# EAGLE schematic TouScruino-v3 (EAGLE 6.3)
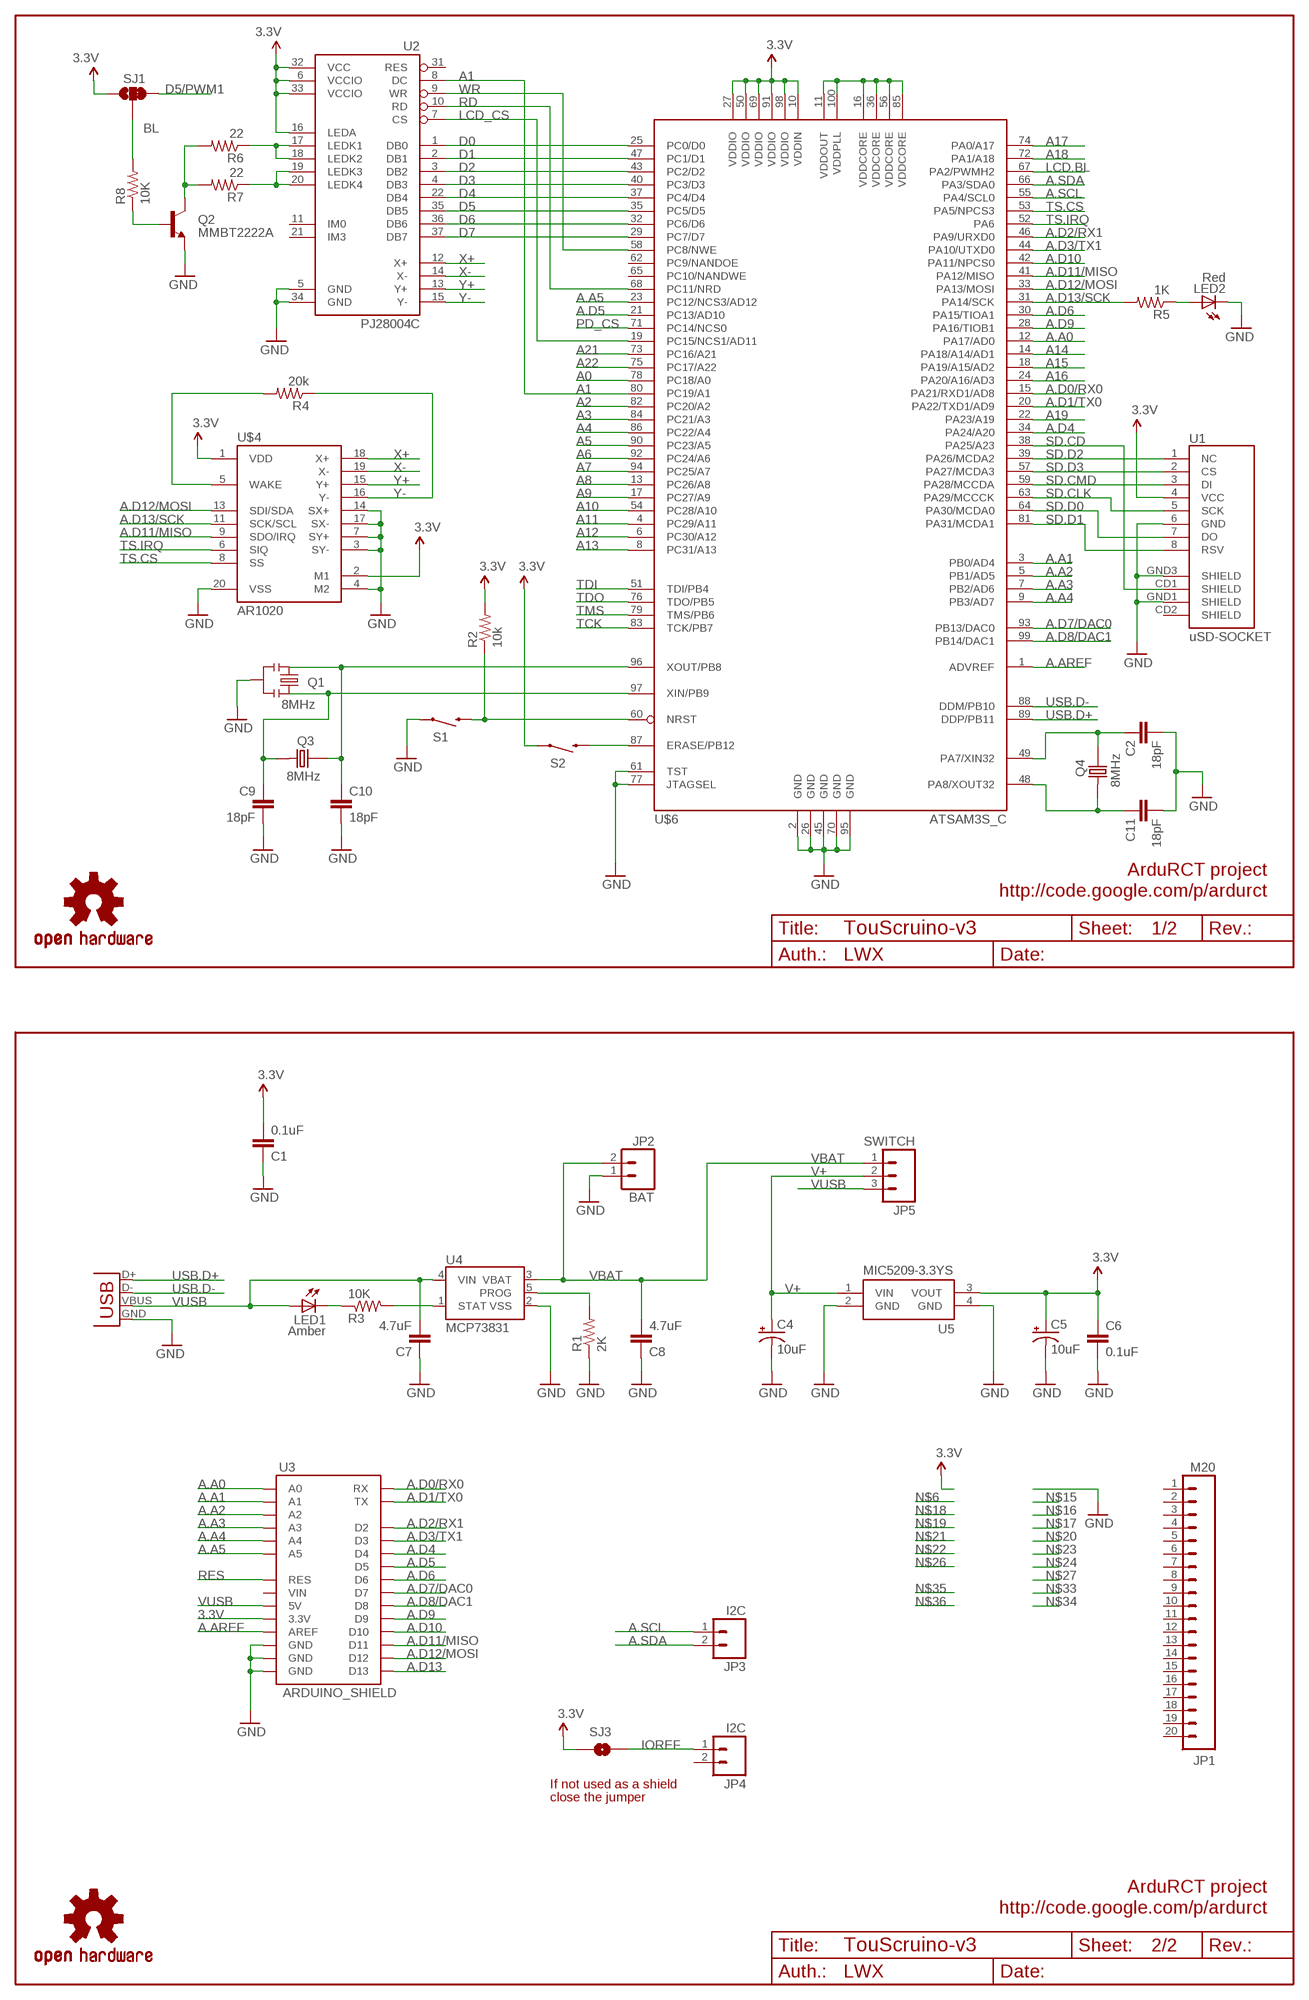
[diagram p0: schematic, sheet 1]

## Parts
C1  0.1uF  CAP0805  [0805]
C2  18pF  CAP0603-CAP  [0603-CAP]
C4  10uF  CAP_POL1206  [EIA3216]
C5  10uF  CAP_POL1206  [EIA3216]
C6  0.1uF  CAP0805  [0805]
C7  4.7uF  CAP0805  [0805]
C8  4.7uF  CAP0805  [0805]
C9  18pF  CAP0603-CAP  [0603-CAP]
C10  18pF  CAP0603-CAP  [0603-CAP]
C11  18pF  CAP0603-CAP  [0603-CAP]
JP1  M20  [1X20]
JP2  BAT  M02-JST-2MM-SMT  [JST-2-SMD]
JP3  I2C  M02  [1X02]
JP4  I2C  M02  [1X02]
JP5  SWITCH  M03  [1X3_LONGPAD]
LED1  Amber  LED  [LED]
LED2  Red  LED805  [LED-0805]
Q1  8MHz  RESONATORSMD  [RESONATOR-SMD]
Q2  MMBT2222A  TRANSISTOR_NPNSOT23-3  [SOT23-3]
Q3  8MHz  CRYSTAL_5X3.2  [CRYSTAL_5X3.2]
Q4  8MHz  CRYSTAL_5X3.2  [CRYSTAL_5X3.2]
R1  2K  RESISTOR0805-RES  [0805]
R2  10k  RESISTOR0805-RES  [0805]
R3  10K  RESISTOR0805-RES  [0805]
R4  20k  RESISTOR0805-RES  [0805]
R5  1K  RESISTOR0805-RES  [0805]
R6  22  RESISTOR0805-RES  [0805]
R7  22  RESISTOR0805-RES  [0805]
R8  10K  RESISTOR0805-RES  [0805]
S1  SWITCH-MOMENTARY-2SMD  [TACTILE_SWITCH_SMD]
S2  SWITCH-MOMENTARY-2SMD  [TACTILE_SWITCH_SMD]
SJ1  SJ_2WAYS_1-2  [SJ_2WAYS_1-2_S]
SJ3  SOLDERJUMPERNO  [SJ_2S-NO]
U1  uSD-SOCKET  USD-SOCKETNEW  [MICRO-SD-SOCKET-PP]
U2  PJ28004C  [PJ28004C]
U3  ARDUINO_SHIELD  [ARDUINO_SHIELD]
U4  MCP73831  [SOT23-5]
U5  MIC5209-3.3YS  MIC5209  [SOT223]
U$3  OSHW-LOGOM  [OSHW-LOGO-M]
U$4  AR1020  [SSOP20]
U$5  OSHW-LOGOM  [OSHW-LOGO-M]
U$6  ATSAM3S_C  [TQFP100]
X1  USBSMD  [USB-MINIB]

## Nets
3.3V: C1.2 C5.A(+) C6.1 R2.2 S2.1 SJ1.3 SJ3.1 U1.4(VCC) U2.6(VCCIO) U2.16(LEDA) U2.32(VCC) U2.33(VCCIO) U3.3.3V U5.3(VOUT) U$4.1(VDD) U$4.2(M1) U$6.10(VDDIN) U$6.27(VDDIO) U$6.50(VDDIO) U$6.69(VDDIO) U$6.91(VDDIO) U$6.98(VDDIO)
A0: U$6.78(PC18/A0)
A1: U2.8(DC) U$6.80(PC19/A1)
A2: U$6.82(PC20/A2)
A3: U$6.84(PC21/A3)
A4: U$6.86(PC22/A4)
A5: U$6.90(PC23/A5)
A6: U$6.92(PC24/A6)
A7: U$6.94(PC25/A7)
A8: U$6.13(PC26/A8)
A9: U$6.17(PC27/A9)
A10: U$6.54(PC28/A10)
A11: U$6.4(PC29/A11)
A12: U$6.6(PC30/A12)
A13: U$6.8(PC31/A13)
A14: U$6.14(PA18/A14/AD1)
A15: U$6.18(PA19/A15/AD2)
A16: U$6.24(PA20/A16/AD3)
A17: U$6.74(PA0/A17)
A18: U$6.72(PA1/A18)
A19: U$6.22(PA23/A19)
A21: U$6.73(PC16/A21)
A22: U$6.75(PC17/A22)
A.A0: U3.A0 U$6.12(PA17/AD0)
A.A1: U3.A1 U$6.3(PB0/AD4)
A.A2: U3.A2 U$6.5(PB1/AD5)
A.A3: U3.A3 U$6.7(PB2/AD6)
A.A4: U3.A4 U$6.9(PB3/AD7)
A.A5: U3.A5 U$6.23(PC12/NCS3/AD12)
A.AREF: U3.AREF U$6.1(ADVREF)
A.D0/RX0: U3.RX U$6.15(PA21/RXD1/AD8)
A.D1/TX0: U3.TX U$6.20(PA22/TXD1/AD9)
A.D2/RX1: U3.D2 U$6.46(PA9/URXD0)
A.D3/TX1: U3.D3 U$6.44(PA10/UTXD0)
A.D4: U3.D4 U$6.34(PA24/A20)
A.D5: U3.D5 U$6.21(PC13/AD10)
A.D6: U3.D6 U$6.30(PA15/TIOA1)
A.D7/DAC0: U3.D7 U$6.93(PB13/DAC0)
A.D8/DAC1: U3.D8 U$6.99(PB14/DAC1)
A.D9: U3.D9 U$6.28(PA16/TIOB1)
A.D10: U3.D10 U$6.42(PA11/NPCS0)
A.D11/MISO: U3.D11 U$4.9(SDO/IRQ) U$6.41(PA12/MISO)
A.D12/MOSI: U3.D12 U$4.13(SDI/SDA) U$6.33(PA13/MOSI)
A.D13: U3.D13
A.D13/SCK: R5.2 U$4.11(SCK/SCL) U$6.31(PA14/SCK)
A.SCL: JP3.1 U$6.55(PA4/SCL0)
A.SDA: JP3.2 U$6.66(PA3/SDA0)
BL: R8.2 SJ1.2
D0: U2.1(DB0) U$6.25(PC0/D0)
D1: U2.2(DB1) U$6.47(PC1/D1)
D2: U2.3(DB2) U$6.43(PC2/D2)
D3: U2.4(DB3) U$6.40(PC3/D3)
D4: U2.22(DB4) U$6.37(PC4/D4)
D5: U2.35(DB5) U$6.35(PC5/D5)
D5/PWM1: SJ1.1
D6: U2.36(DB6) U$6.32(PC6/D6)
D7: U2.37(DB7) U$6.29(PC7/D7)
GND [vcc]: C1.1 C2.2 C4.C(-) C5.C(-) C6.2 C7.1 C8.1 C9.2 C10.2 C11.2 JP2.1 LED2.2(C) Q1.2 Q2.2(E) R1.1 S1.1 U1.6(GND) U1.GND1(SHIELD) U1.GND3(SHIELD) U2.5(GND) U2.34(GND) U3.GND@0(GND) U3.GND@1(GND) U3.GND@2(GND) U4.2(VSS) U5.2(GND) U5.4(GND) U$4.3(SY-) U$4.4(M2) U$4.7(SY+) U$4.14(SX+) U$4.17(SX-) U$4.20(VSS) U$6.2(GND) U$6.26(GND) U$6.45(GND) U$6.61(TST) U$6.70(GND) U$6.77(JTAGSEL) U$6.95(GND) X1.GND
IOREF: JP4.1 SJ3.2
LCD.BL: U$6.67(PA2/PWMH2)
LCD_CS: U2.7(CS) U$6.19(PC15/NCS1/AD11)
N$1: C9.1 Q1.1 Q3.2 U$6.97(XIN/PB9)
N$2: C10.1 Q1.3 Q3.1 U$6.96(XOUT/PB8)
N$4: Q2.1(B) R8.1
N$5: LED2.1(A) R5.1
N$7: Q2.3(C) R6.2 R7.2
N$8: LED1.C1(C) R3.1
N$9: R2.1 S1.3 U$6.60(NRST)
N$10: U$6.11(VDDOUT) U$6.16(VDDCORE) U$6.36(VDDCORE) U$6.56(VDDCORE) U$6.85(VDDCORE) U$6.100(VDDPLL)
N$11: R4.2 U$4.5(WAKE)
N$12: R3.2 U4.1(STAT)
N$13: R1.2 U4.5(PROG)
N$14: S2.3 U$6.87(ERASE/PB12)
N$25: R7.1 U2.19(LEDK3) U2.20(LEDK4)
N$32: R6.1 U2.17(LEDK1) U2.18(LEDK2)
N$45: C2.1 Q4.1 U$6.49(PA7/XIN32)
N$46: C11.1 Q4.2 U$6.48(PA8/XOUT32)
PD_CS: U$6.71(PC14/NCS0)
RD: U2.10(RD) U$6.68(PC11/NRD)
RES: U3.RES
SD.CD: U1.CD1(SHIELD) U$6.38(PA25/A23)
SD.CLK: U1.5(SCK) U$6.63(PA29/MCCCK)
SD.CMD: U1.3(DI) U$6.59(PA28/MCCDA)
SD.D0: U1.7(DO) U$6.64(PA30/MCDA0)
SD.D1: U1.8(RSV) U$6.81(PA31/MCDA1)
SD.D2: U1.1(NC) U$6.39(PA26/MCDA2)
SD.D3: U1.2(CS) U$6.57(PA27/MCDA3)
TCK: U$6.83(TCK/PB7)
TDI: U$6.51(TDI/PB4)
TDO: U$6.76(TDO/PB5)
TMS: U$6.79(TMS/PB6)
TS.CS: U$4.8(SS) U$6.53(PA5/NPCS3)
TS.IRQ: U$4.6(SIQ) U$6.52(PA6)
USB.D+: U$6.89(DDP/PB11) X1.D+
USB.D-: U$6.88(DDM/PB10) X1.D-
V+: C4.A(+) JP5.2 U5.1(VIN)
VBAT: C8.2 JP2.2 JP5.1 U4.3(VBAT)
VUSB: C7.2 JP5.3 LED1.A1(A) U3.5V U4.4(VIN) X1.VBUS
WR: U2.9(WR) U$6.58(PC8/NWE)
X+: U2.12(X+) U$4.18(X+)
X-: U2.14(X-) U$4.19(X-)
Y+: U2.13(Y+) U$4.15(Y+)
Y-: R4.1 U2.15(Y-) U$4.16(Y-)
Unconnected: JP1.1 JP1.2 JP1.3 JP1.4 JP1.5 JP1.6 JP1.7 JP1.8 JP1.9 JP1.10 JP1.11 JP1.12 JP1.13 JP1.14 JP1.15 JP1.16 JP1.17 JP1.18 JP1.19 JP1.20 JP4.2 U1.CD2(SHIELD) U2.11(IM0) U2.21(IM3) U2.31(RES) U3.VIN U$6.62(PC9/NANDOE) U$6.65(PC10/NANDWE)

## Notes on the sheet
- ArduRCT project
- http://code.google.com/p/ardurct
- 1/2
- LWX
- If not used as a shield
- close the jumper
- ArduRCT project
- http://code.google.com/p/ardurct
- 2/2
- LWX

## Library data of the parts
C1 C2 C6-C11 = SparkFun:CAP: Capacitor Standard 0603 ceramic capacitor, and 0.1" leaded capacitor.
C4 C5 = SparkFun:CAP_POL: Capacitor Polarized These are standard SMD and PTH capacitors. Normally 10uF, 47uF, and 100uF in electrolytic and tantalum varieties. Always verify the external diameter of the through hole cap, it varies with capacity, voltage, and manufacturer. The EIA devices should be standard.
JP1 = SparkFun:M20: This is just like the LOCK variant in that the holes are staggared by 5 mil, but except for the last two holes. They are not altered from the "standard" footprint layout. This is used for a special purpose on the layout of our Graphic LCD Backpack. Make sure you want to use this device before selecting it for you project!
JP2 = SparkFun:M02: Header 2 Standard 2-pin 0.1" header. Use with straight break away headers (SKU : PRT-00116), right angle break away headers (PRT-00553), swiss pins (PRT-00743), machine pins (PRT-00117), and female headers (PRT-00115). Molex polarized connector foot print use with SKU : PRT-08233 with associated crimp pins and housings.
JP3 JP4 = wibauxl:M02
JP5 = wibauxl:M03
LED1 LED2 = wibauxl:LED
Q1 = SparkFun:RESONATOR: Resonator Small SMD resonator. This is the itty bitty 10/20MHz resonators with built in caps. CSTCE10M0G55 and CSTCE20M0V53. Footprint has been reviewed closely but hasn't been tested yet.
Q2 = SparkFun:TRANSISTOR_NPN: Transistor NPN BJT configuration in SOT23 package. MMBT2222 is the common NPN we use. Double check BCE configuration again layout.
Q3 Q4 = wibauxl:CRYSTAL_5X3.2
R1-R8 = SparkFun:RESISTOR: Resistor Basic schematic elements and footprints for 0603, 1206, and PTH resistors.
S1 S2 = SparkFun:SWITCH-MOMENTARY-2
SJ1 = wibauxl:SJ_2WAYS_1-2
SJ3 = SparkFun:SOLDERJUMPER: Solder Jumper Standard SMD solder jumper. Used to automate production. Two varients : Normally Open and Normally Closed are the same, but have different paste layers. NC will have a large amount of paste and should jumper during reflow.
U1 = SparkFun:USD-SOCKET: microSD Socket Push-push type uSD socket. Schematic element and footprint production proven. Spark Fun Electronics SKU : PRT-00127. tDoc lines correctly indicate media card edge positions when inserting (unlocked, locked, depressed).
U2 = wibauxl:PJ28004C
U3 = wibauxl:ARDUINO_SHIELD
U4 = SparkFun:MCP73831: Microchip's MCP73831 Miniature single cell, fully integrated Li-Ion, Li-polymer charge management controller http://ww1.microchip.com/downloads/en/DeviceDoc/21984a.pdf
U5 = wibauxl:MIC5209
U$3 U$5 = SparkFun:OSHW-LOGO: Open Source Hardware Logo This logo indicates the piece of hardware it is found on incorporates a OSHW license and/or adheres to the definition of open source hardware found here: http://freedomdefined.org/OSHW
U$4 = wibauxl:AR1020
U$6 = wibauxl:ATSAM3S_C
X1 = SparkFun:USB: USB Connectors USB-B-PTH is fully proven SKU : PRT-00139 USB-miniB is fully proven SKU : PRT-00587 USB-A-PCB is untested. USB-A-H is throughly reviewed, but untested. Spark Fun Electronics SKU : PRT-00437 USB-B-SMT is throughly reviewed, but untested. Needs silkscreen touching up. USB-A-S has not been used/tested USB-MB-H has not been used/tested

## Net classes
0 default: width 0.203 mm
1 vcc: width 0.254 mm